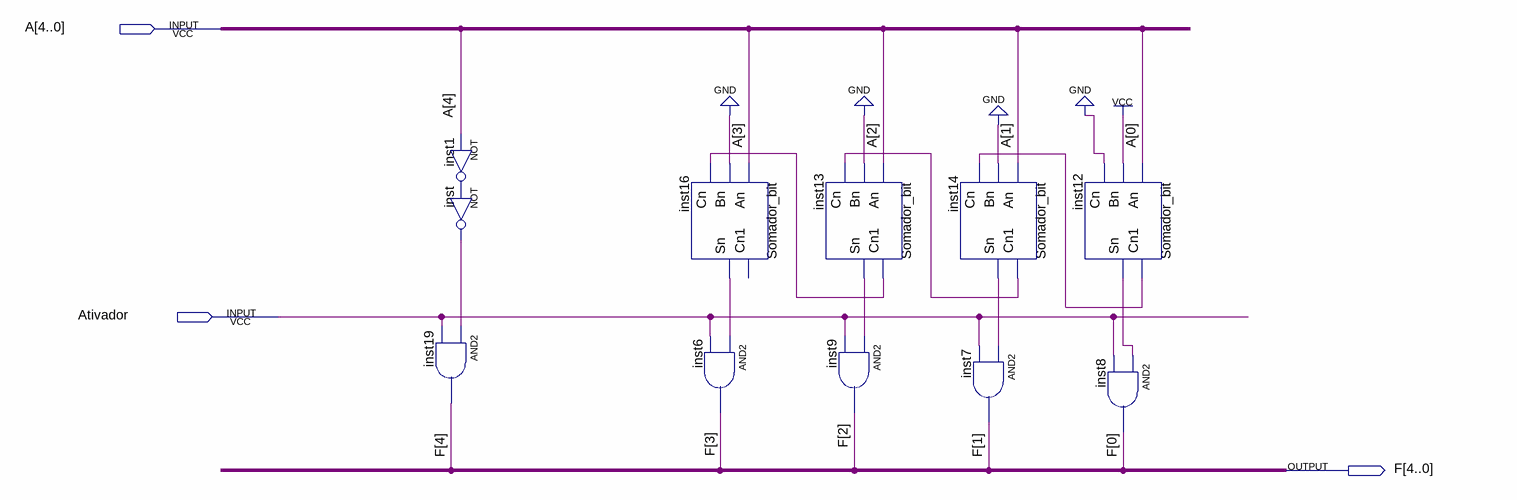
[diagram p0: schematic sheet]
// Quartus schematic soma1_5bits.bdf as structural Verilog: 11 symbols, 3 pins
module soma1_5bits (
  input  [4:0] A,
  input  Ativador,
  output [4:0] F
);

  wire inst1_out, inst12_cn1, inst12_sn, inst13_cn1, inst13_sn, inst14_cn1, inst14_sn, inst16_sn, inst_out;

  not inst1 (inst1_out, A[4]);
  not inst (inst_out, inst1_out);
  and inst19 (F[4], inst_out, Ativador);
  Somador_bit inst16 (.An(A[3]), .Bn(1'b0), .Cn(inst13_cn1), .Sn(inst16_sn));  // open: Cn1
  and inst6 (F[3], inst16_sn, Ativador);
  Somador_bit inst13 (.An(A[2]), .Bn(1'b0), .Cn(inst14_cn1), .Cn1(inst13_cn1), .Sn(inst13_sn));
  and inst9 (F[2], inst13_sn, Ativador);
  Somador_bit inst14 (.An(A[1]), .Bn(1'b0), .Cn(inst12_cn1), .Cn1(inst14_cn1), .Sn(inst14_sn));
  and inst7 (F[1], inst14_sn, Ativador);
  Somador_bit inst12 (.An(A[0]), .Bn(1'b1), .Cn(1'b0), .Cn1(inst12_cn1), .Sn(inst12_sn));
  and inst8 (F[0], inst12_sn, Ativador);
endmodule
